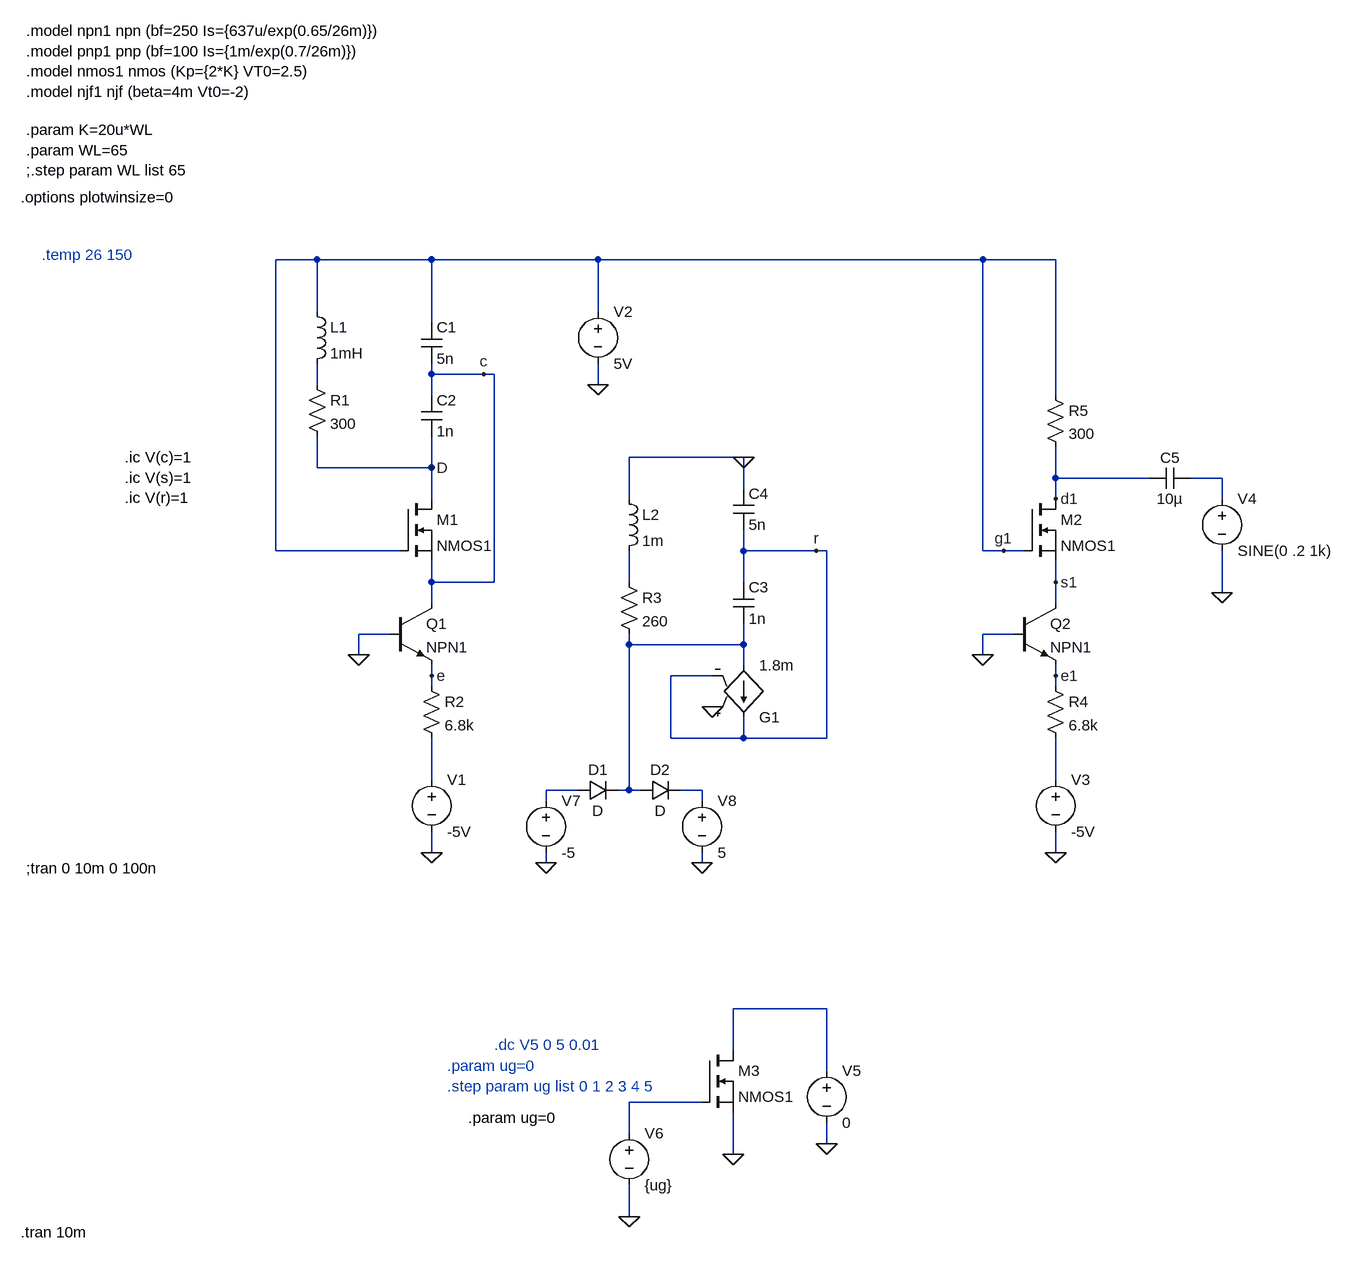
[diagram p0: schematic ss2013_collpits.asc]
ss2013_collpits.asc, the LTspice schematic file:
Version 4
SHEET 1 880 856
WIRE -1040 -656 -1104 -656
WIRE -864 -656 -1040 -656
WIRE -608 -656 -864 -656
WIRE -16 -656 -608 -656
WIRE 96 -656 -16 -656
WIRE -1040 -576 -1040 -656
WIRE -608 -576 -608 -656
WIRE -864 -560 -864 -656
WIRE -864 -480 -864 -496
WIRE -784 -480 -864 -480
WIRE -768 -480 -784 -480
WIRE -1040 -464 -1040 -496
WIRE -608 -464 -608 -496
WIRE -864 -448 -864 -480
WIRE 96 -448 96 -656
WIRE -384 -352 -560 -352
WIRE -1040 -336 -1040 -384
WIRE -864 -336 -864 -384
WIRE -864 -336 -1040 -336
WIRE 96 -320 96 -368
WIRE 240 -320 96 -320
WIRE 352 -320 304 -320
WIRE -384 -304 -384 -352
WIRE -864 -288 -864 -336
WIRE -560 -288 -560 -352
WIRE 96 -288 96 -320
WIRE 352 -288 352 -320
WIRE -1104 -208 -1104 -656
WIRE -912 -208 -1104 -208
WIRE -384 -208 -384 -240
WIRE -272 -208 -384 -208
WIRE -256 -208 -272 -208
WIRE -16 -208 -16 -656
WIRE 16 -208 -16 -208
WIRE 48 -208 16 -208
WIRE -864 -160 -864 -192
WIRE -768 -160 -768 -480
WIRE -768 -160 -864 -160
WIRE -560 -160 -560 -208
WIRE -384 -160 -384 -208
WIRE 96 -160 96 -192
WIRE 352 -144 352 -208
WIRE -864 -128 -864 -160
WIRE 96 -128 96 -160
WIRE -928 -80 -976 -80
WIRE 32 -80 -16 -80
WIRE -560 -64 -560 -80
WIRE -384 -64 -384 -96
WIRE -384 -64 -560 -64
WIRE -976 -48 -976 -80
WIRE -16 -48 -16 -80
WIRE -384 -32 -384 -64
WIRE -864 -16 -864 -32
WIRE -432 -16 -496 -16
WIRE 96 -16 96 -32
WIRE -864 0 -864 -16
WIRE 96 0 96 -16
WIRE -496 80 -496 -16
WIRE -384 80 -384 48
WIRE -384 80 -496 80
WIRE -256 80 -256 -208
WIRE -256 80 -384 80
WIRE -864 144 -864 80
WIRE 96 144 96 80
WIRE -640 160 -688 160
WIRE -560 160 -560 -64
WIRE -560 160 -576 160
WIRE -544 160 -560 160
WIRE -448 160 -480 160
WIRE -688 176 -688 160
WIRE -448 176 -448 160
WIRE -864 256 -864 224
WIRE 96 256 96 224
WIRE -688 272 -688 256
WIRE -448 272 -448 256
WIRE -256 496 -400 496
WIRE -400 560 -400 496
WIRE -256 592 -256 496
WIRE -448 640 -560 640
WIRE -560 688 -560 640
WIRE -256 704 -256 672
WIRE -400 720 -400 656
WIRE -560 816 -560 768
FLAG -608 -464 0
FLAG -864 256 0
FLAG -976 -48 0
FLAG -784 -480 c
FLAG -864 -336 D
FLAG -864 -16 e
FLAG -384 -352 0
FLAG -432 32 0
FLAG -272 -208 r
FLAG 96 256 0
FLAG -16 -48 0
FLAG 352 -144 0
FLAG 16 -208 g1
FLAG 96 -160 s1
FLAG 96 -16 e1
FLAG 96 -288 d1
FLAG -256 704 0
FLAG -400 720 0
FLAG -560 816 0
FLAG -448 272 0
FLAG -688 272 0
SYMBOL ind -1056 -592 R0
SYMATTR InstName L1
SYMATTR Value 1mH
SYMBOL res -1056 -480 R0
SYMATTR InstName R1
SYMATTR Value 300
SYMBOL cap -880 -560 R0
SYMATTR InstName C1
SYMATTR Value 5n
SYMBOL cap -880 -448 R0
SYMATTR InstName C2
SYMATTR Value 1n
SYMBOL nmos -912 -288 R0
SYMATTR InstName M1
SYMATTR Value NMOS1
SYMBOL npn -928 -128 R0
SYMATTR InstName Q1
SYMATTR Value NPN1
SYMBOL res -880 -16 R0
SYMATTR InstName R2
SYMATTR Value 6.8k
SYMBOL voltage -864 128 R0
WINDOW 123 0 0 Left 2
WINDOW 39 0 0 Left 2
SYMATTR InstName V1
SYMATTR Value -5V
SYMBOL voltage -608 -592 R0
SYMATTR InstName V2
SYMATTR Value 5V
SYMBOL g -384 64 M180
SYMATTR InstName G1
SYMATTR Value 1.8m
SYMBOL cap -400 -160 R0
SYMATTR InstName C3
SYMATTR Value 1n
SYMBOL cap -400 -304 R0
SYMATTR InstName C4
SYMATTR Value 5n
SYMBOL res -576 -176 R0
SYMATTR InstName R3
SYMATTR Value 260
SYMBOL ind -576 -304 R0
SYMATTR InstName L2
SYMATTR Value 1m
SYMBOL nmos 48 -288 R0
SYMATTR InstName M2
SYMATTR Value NMOS1
SYMBOL npn 32 -128 R0
SYMATTR InstName Q2
SYMATTR Value NPN1
SYMBOL res 80 -16 R0
SYMATTR InstName R4
SYMATTR Value 6.8k
SYMBOL voltage 96 128 R0
WINDOW 123 0 0 Left 2
WINDOW 39 0 0 Left 2
SYMATTR InstName V3
SYMATTR Value -5V
SYMBOL res 80 -464 R0
SYMATTR InstName R5
SYMATTR Value 300
SYMBOL voltage 352 -304 R0
WINDOW 123 0 0 Left 2
WINDOW 39 0 0 Left 2
SYMATTR InstName V4
SYMATTR Value SINE(0 .2 1k)
SYMBOL cap 304 -336 R90
WINDOW 0 0 32 VBottom 2
WINDOW 3 32 32 VTop 2
SYMATTR InstName C5
SYMATTR Value 10µ
SYMBOL nmos -448 560 R0
SYMATTR InstName M3
SYMATTR Value NMOS1
SYMBOL voltage -256 576 R0
WINDOW 123 0 0 Left 2
WINDOW 39 0 0 Left 2
SYMATTR InstName V5
SYMATTR Value 0
SYMBOL voltage -560 672 R0
WINDOW 123 0 0 Left 2
WINDOW 39 0 0 Left 2
SYMATTR InstName V6
SYMATTR Value {ug}
SYMBOL voltage -688 160 R0
WINDOW 123 0 0 Left 2
WINDOW 39 0 0 Left 2
SYMATTR InstName V7
SYMATTR Value -5
SYMBOL voltage -448 160 R0
WINDOW 123 0 0 Left 2
WINDOW 39 0 0 Left 2
SYMATTR InstName V8
SYMATTR Value 5
SYMBOL diode -640 176 R270
WINDOW 0 32 32 VTop 2
WINDOW 3 0 32 VBottom 2
SYMATTR InstName D1
SYMBOL diode -544 176 R270
WINDOW 0 32 32 VTop 2
WINDOW 3 0 32 VBottom 2
SYMATTR InstName D2
TEXT -1488 -1008 Left 2 !.model npn1 npn (bf=250 Is={637u/exp(0.65/26m)})\n.model pnp1 pnp (bf=100 Is={1m/exp(0.7/26m)})\n.model nmos1 nmos (Kp={2*K} VT0=2.5)\n.model njf1 njf (beta=4m Vt0=-2)
TEXT -1488 280 Left 2 !;tran 0 10m 0 100n
TEXT -1336 -352 Left 2 !.ic V(c)=1\n.ic V(s)=1\n.ic V(r)=1
TEXT -1488 -856 Left 2 !.param K=20u*WL\n.param WL=65\n;.step param WL list 65
TEXT -1496 -752 Left 2 !.options plotwinsize=0
TEXT -1464 -664 Left 2 ;.temp 26 150
TEXT -768 552 Left 2 ;.dc V5 0 5 0.01
TEXT -840 584 Left 2 ;.param ug=0\n.step param ug list 0 1 2 3 4 5
TEXT -1496 840 Left 2 !.tran 10m
TEXT -808 664 Left 2 !.param ug=0

The netlist it stands for:
* ss2013_collpits.asc
L1 g1 N001 1mH
R1 N001 D 300
C1 g1 c 5n
C2 c D 1n
M1 D g1 c c NMOS1
Q1 c 0 e 0 NPN1
R2 e N005 6.8k
V1 N005 0 -5V
V2 g1 0 5V
G1 N004 r 0 r 1.8m
C3 r N004 1n
C4 0 r 5n
R3 N003 N004 260
L2 0 N003 1m
M2 d1 g1 s1 s1 NMOS1
Q2 s1 0 e1 0 NPN1
R4 e1 N006 6.8k
V3 N006 0 -5V
R5 g1 d1 300
V4 N002 0 SINE(0 .2 1k)
C5 N002 d1 10µ
M3 N009 N010 0 0 NMOS1
V5 N009 0 0
V6 N010 0 {ug}
V7 N007 0 -5
V8 N008 0 5
D1 N007 N004 D
D2 N004 N008 D
.model D D
.lib standard.dio
.model NPN NPN
.model PNP PNP
.lib standard.bjt
.model NMOS NMOS
.model PMOS PMOS
.lib standard.mos
.model npn1 npn (bf=250 Is={637u/exp(0.65/26m)})
.model pnp1 pnp (bf=100 Is={1m/exp(0.7/26m)})
.model nmos1 nmos (Kp={2*K} VT0=2.5)
.model njf1 njf (beta=4m Vt0=-2)
;tran 0 10m 0 100n
.ic V(c)=1
.ic V(s)=1
.ic V(r)=1
.param K=20u*WL
.param WL=65
;.step param WL list 65
.options plotwinsize=0
* .temp 26 150
* .dc V5 0 5 0.01
* .param ug=0
* .step param ug list 0 1 2 3 4 5
.tran 10m
.param ug=0
.backanno
.end